# EAGLE schematic Temperature Board (EAGLE 7.5.0)
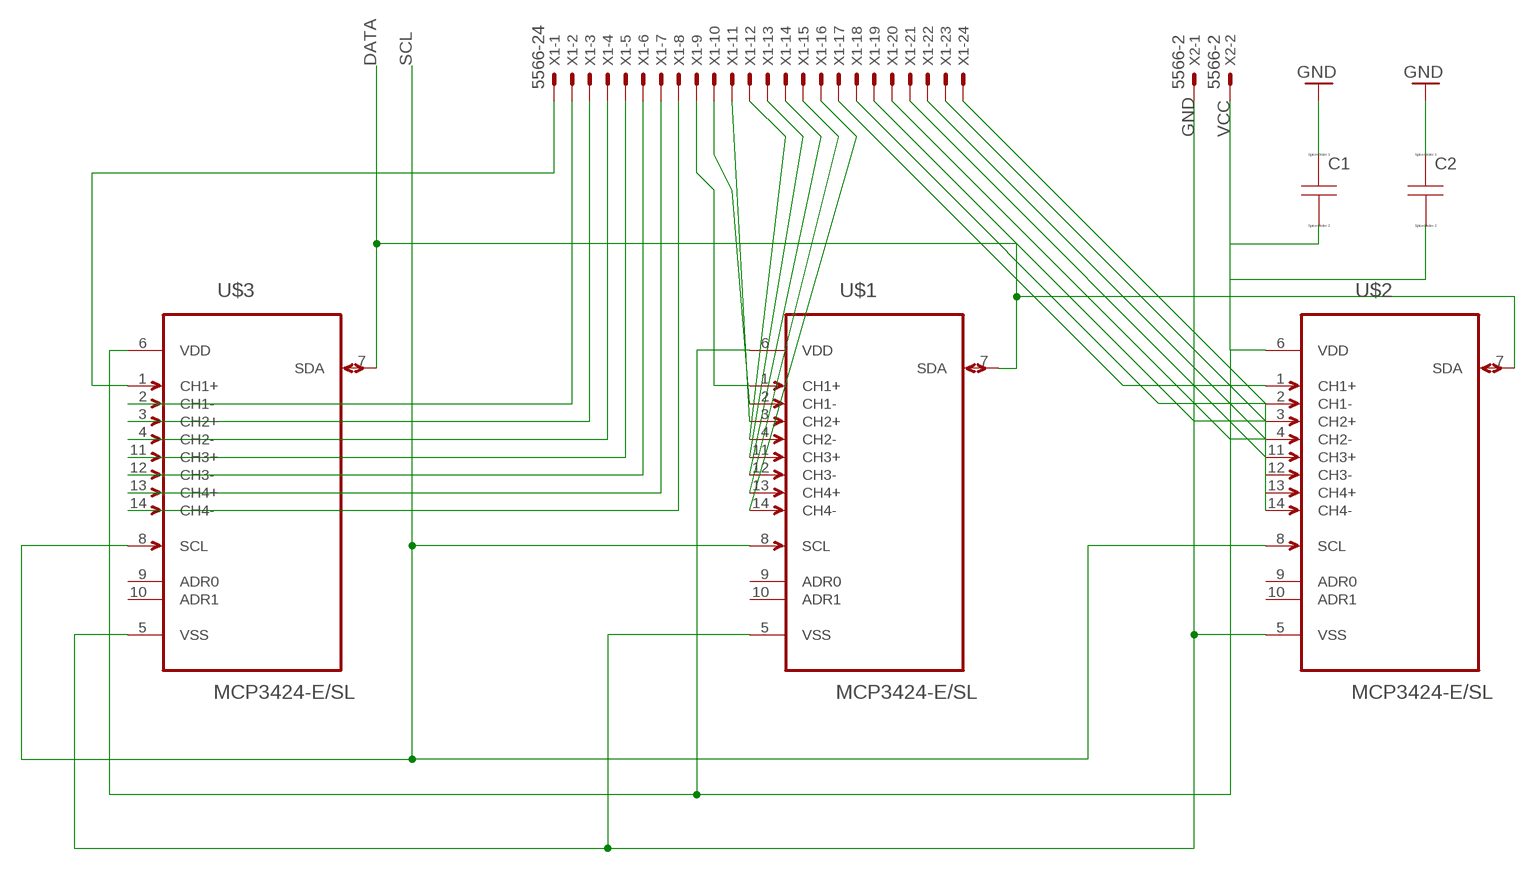
[diagram p0: schematic, sheet 1]

## Parts
C1  CAP  [C0805]
C2  CAP  [C0805]
U$1  MCP3424-E/SL  [SOIC127P600X175-14N]
U$2  MCP3424-E/SL  [SOIC127P600X175-14N]
U$3  MCP3424-E/SL  [SOIC127P600X175-14N]
X1  5566-24  [5566-24]
X2  5566-2  [5566-2]

## Nets
DATA: U$1.7(SDA) U$2.7(SDA) U$3.7(SDA)
GND: C1.1(A) C2.1(A) U$1.5(VSS) U$2.5(VSS) U$3.5(VSS) X2.1
N$1: U$1.1(CH1+) X1.9
N$2: U$3.1(CH1+) X1.1
N$3: U$3.2(CH1-) X1.2
N$4: U$1.2(CH1-) X1.10
N$5: U$3.3(CH2+) X1.3
N$6: U$3.4(CH2-) X1.4
N$7: U$3.11(CH3+) X1.5
N$8: U$3.12(CH3-) X1.6
N$9: U$3.13(CH4+) X1.7
N$10: U$3.14(CH4-) X1.8
N$11: U$1.3(CH2+) X1.11
N$12: U$1.4(CH2-) X1.12
N$13: U$1.11(CH3+) X1.13
N$14: U$1.12(CH3-) X1.14
N$15: U$1.13(CH4+) X1.15
N$16: U$1.14(CH4-) X1.16
N$17: U$2.1(CH1+) X1.17
N$18: U$2.2(CH1-) X1.18
N$19: U$2.3(CH2+) X1.19
N$20: U$2.4(CH2-) X1.20
N$21: U$2.11(CH3+) X1.21
N$22: U$2.12(CH3-) X1.22
N$23: U$2.13(CH4+) X1.23
N$24: U$2.14(CH4-) X1.24
SCL: U$1.8(SCL) U$2.8(SCL) U$3.8(SCL)
VCC: C1.2(B) C2.2(B) U$1.6(VDD) U$2.6(VDD) U$3.6(VDD) X2.2
Unconnected: U$1.9(ADR0) U$1.10(ADR1) U$2.9(ADR0) U$2.10(ADR1) U$3.9(ADR0) U$3.10(ADR1)

## Library data of the parts
C1 C2 = sym:CAP: Capacitor
U$1-U$3 = Microchip_By_element14_Batch_1:MCP3424-E/SL: Analog-to-Digital Converter; MPN: MCP3424-E/SL; OC_FARNELL: 1630424; OC_NEWARK: 54M4871; PACKAGE: SOIC-14; SUPPLIER: Microchip
X1 = con-molex:5566-24: Mini FIT connector 24 pol Source: http://www.molex.com; OC_FARNELL: unknown; OC_NEWARK: unknown
X2 = con-molex:5566-2: Mini FIT connector 2 pol Source: http://www.molex.com; OC_FARNELL: 1822072; OC_NEWARK: unknown